# EAGLE schematic RGB_speakerbadge_thruvias (EAGLE 5.11)

## Sheet 1 of 2
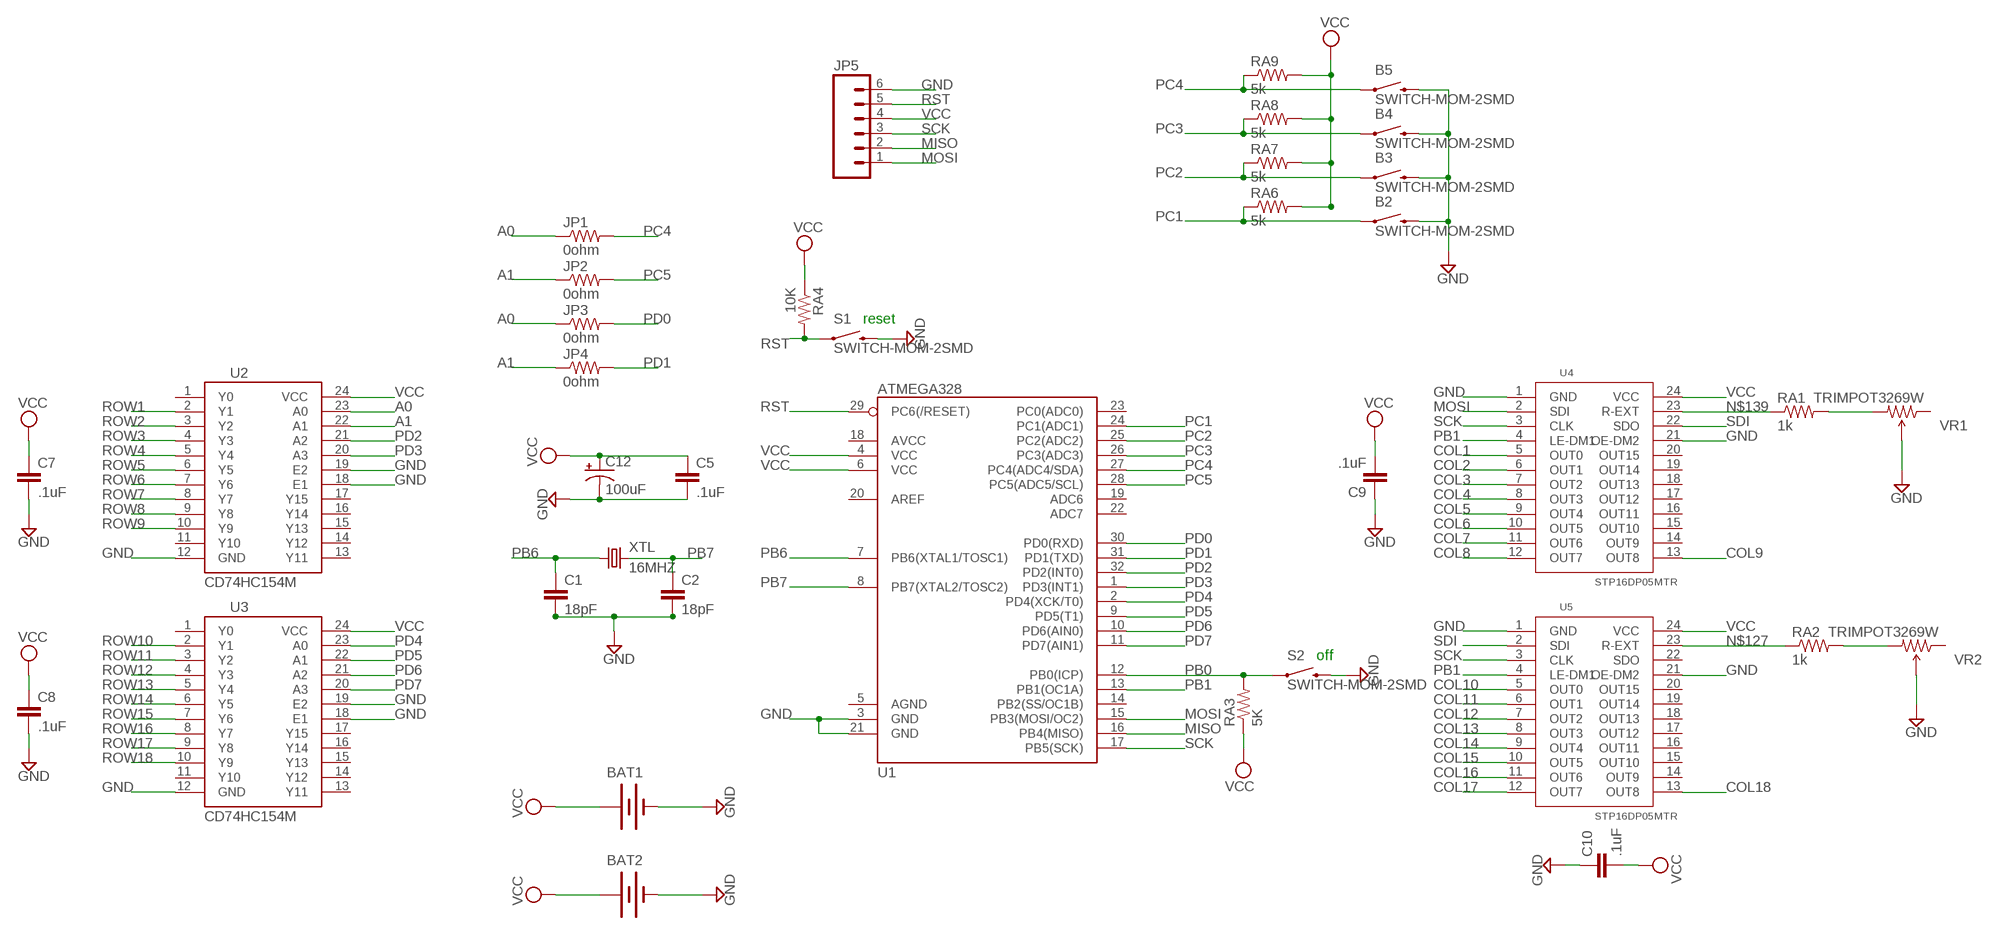
[diagram p0: schematic, sheet 1]

### Parts
B2  SWITCH-MOM-2SMD  SWITCH-MOMENTARY-2SMD  [TACTILE_SWITCH_SMD]
B3  SWITCH-MOM-2SMD  SWITCH-MOMENTARY-2SMD  [TACTILE_SWITCH_SMD]
B4  SWITCH-MOM-2SMD  SWITCH-MOMENTARY-2SMD  [TACTILE_SWITCH_SMD]
B5  SWITCH-MOM-2SMD  SWITCH-MOMENTARY-2SMD  [TACTILE_SWITCH_SMD]
BAT1  NSL_SPARKFUN_BATTERY245MM  [NSL_SPARKFUN_BATTCON_245MM]
BAT2  NSL_SPARKFUN_BATTERY245MM  [NSL_SPARKFUN_BATTCON_245MM]
C1  18pF  SPARKFUN_CAP0603-CAP  [SPARKFUN_0603-CAP]
C2  18pF  SPARKFUN_CAP0603-CAP  [SPARKFUN_0603-CAP]
C5  .1uF  SPARKFUN_CAP0603-CAP  [SPARKFUN_0603-CAP]
C7  .1uF  SPARKFUN_CAP0603-CAP  [SPARKFUN_0603-CAP]
C8  .1uF  SPARKFUN_CAP0603-CAP  [SPARKFUN_0603-CAP]
C9  .1uF  SPARKFUN_CAP0603-CAP  [SPARKFUN_0603-CAP]
C10  .1uF  SPARKFUN_CAP0603-CAP  [SPARKFUN_0603-CAP]
C12  100uF  CAP_POLD  [PANASONIC_D]
JP1  0ohm  SPARKFUN_RESISTOR0603-RES  [SPARKFUN_0603-RES]
JP2  0ohm  SPARKFUN_RESISTOR0603-RES  [SPARKFUN_0603-RES]
JP3  0ohm  SPARKFUN_RESISTOR0603-RES  [SPARKFUN_0603-RES]
JP4  0ohm  SPARKFUN_RESISTOR0603-RES  [SPARKFUN_0603-RES]
JP5  M061X06-SMD_EDGE_FEMALE  [1X06-SMD_EDGE]
RA1  1k  SPARKFUN_RESISTOR0603-RES  [SPARKFUN_0603-RES]
RA2  1k  SPARKFUN_RESISTOR0603-RES  [SPARKFUN_0603-RES]
RA3  5K  SPARKFUN_RESISTOR0603-RES  [SPARKFUN_0603-RES]
RA4  10K  SPARKFUN_RESISTOR0603-RES  [SPARKFUN_0603-RES]
RA6  5k  SPARKFUN_RESISTOR0603-RES  [SPARKFUN_0603-RES]
RA7  5k  SPARKFUN_RESISTOR0603-RES  [SPARKFUN_0603-RES]
RA8  5k  SPARKFUN_RESISTOR0603-RES  [SPARKFUN_0603-RES]
RA9  5k  SPARKFUN_RESISTOR0603-RES  [SPARKFUN_0603-RES]
S1  SWITCH-MOM-2SMD  SWITCH-MOMENTARY-2SMD  [TACTILE_SWITCH_SMD]
S2  SWITCH-MOM-2SMD  SWITCH-MOMENTARY-2SMD  [TACTILE_SWITCH_SMD]
U1  ATMEGA328  ATMEGA168  [TQFP32-08]
U2  CD74HC154M  [SO-24DW]
U3  CD74HC154M  [SO-24DW]
U4  STP16DP05MTR  [STP16DP05MTR]
U5  STP16DP05MTR  [STP16DP05MTR]
VR1  TRIMPOT3269W  [3269W]
VR2  TRIMPOT3269W  [3269W]
XTL  16MHZ  CRYSTALSMD  [HC49UP]

### Nets
A0: JP1.1 JP3.1 U2.23(A0)
A1: JP2.1 JP4.1 U2.22(A1)
COL1: U4.5(OUT0) ; also sheet 2
COL2: U4.6(OUT1) ; also sheet 2
COL3: U4.7(OUT2) ; also sheet 2
COL4: U4.8(OUT3) ; also sheet 2
COL5: U4.9(OUT4) ; also sheet 2
COL6: U4.10(OUT5) ; also sheet 2
COL7: U4.11(OUT6) ; also sheet 2
COL8: U4.12(OUT7)
COL9: U4.13(OUT8) ; also sheet 2
COL10: U5.5(OUT0) ; also sheet 2
COL11: U5.6(OUT1) ; also sheet 2
COL12: U5.7(OUT2) ; also sheet 2
COL13: U5.8(OUT3) ; also sheet 2
COL14: U5.9(OUT4) ; also sheet 2
COL15: U5.10(OUT5) ; also sheet 2
COL16: U5.11(OUT6) ; also sheet 2
COL17: U5.12(OUT7)
COL18: U5.13(OUT8) ; also sheet 2
GND: B2.3 B3.3 B4.3 B5.3 BAT1.2(-) BAT2.2(-) C1.2 C2.2 C5.2 C7.2 C8.2 C9.1 C10.1 C12.- JP5.6 S1.3 S2.3 U1.3(GND) U1.21(GND) U2.12(GND) U2.18(E1) U2.19(E2) U3.12(GND) U3.18(E1) U3.19(E2) U4.1(GND) U4.21(OE-DM2) U5.1(GND) U5.21(OE-DM2) VR1.2(WIPER) VR2.2(WIPER)
MISO: JP5.2 U1.16(PB4(MISO))
MOSI: JP5.1 U1.15(PB3(MOSI/OC2)) U4.2(SDI)
N$37: RA1.2 VR1.3(CW)
N$38: RA2.2 VR2.3(CW)
N$127: RA2.1 U5.23(R-EXT)
N$139: RA1.1 U4.23(R-EXT)
PB0: RA3.2 S2.1 U1.12(PB0(ICP))
PB1: U1.13(PB1(OC1A)) U4.4(LE-DM1) U5.4(LE-DM1)
PB6: C1.1 U1.7(PB6(XTAL1/TOSC1)) XTL.1
PB7: C2.1 U1.8(PB7(XTAL2/TOSC2)) XTL.2
PC1: B2.1 RA6.1 U1.24(PC1(ADC1))
PC2: B3.1 RA7.1 U1.25(PC2(ADC2))
PC3: B4.1 RA8.1 U1.26(PC3(ADC3))
PC4: B5.1 JP1.2 RA9.1 U1.27(PC4(ADC4/SDA))
PC5: JP2.2 U1.28(PC5(ADC5/SCL))
PD0: JP3.2 U1.30(PD0(RXD))
PD1: JP4.2 U1.31(PD1(TXD))
PD2: U1.32(PD2(INT0)) U2.21(A2)
PD3: U1.1(PD3(INT1)) U2.20(A3)
PD4: U1.2(PD4(XCK/T0)) U3.23(A0)
PD5: U1.9(PD5(T1)) U3.22(A1)
PD6: U1.10(PD6(AIN0)) U3.21(A2)
PD7: U1.11(PD7(AIN1)) U3.20(A3)
ROW1: U2.2(Y1) ; also sheet 2
ROW2: U2.3(Y2) ; also sheet 2
ROW3: U2.4(Y3) ; also sheet 2
ROW4: U2.5(Y4) ; also sheet 2
ROW5: U2.6(Y5) ; also sheet 2
ROW6: U2.7(Y6) ; also sheet 2
ROW7: U2.8(Y7) ; also sheet 2
ROW8: U2.9(Y8) ; also sheet 2
ROW9: U2.10(Y9) ; also sheet 2
ROW10: U3.2(Y1) ; also sheet 2
ROW11: U3.3(Y2) ; also sheet 2
ROW12: U3.4(Y3) ; also sheet 2
ROW13: U3.5(Y4) ; also sheet 2
ROW14: U3.6(Y5) ; also sheet 2
ROW15: U3.7(Y6) ; also sheet 2
ROW16: U3.8(Y7) ; also sheet 2
ROW17: U3.9(Y8) ; also sheet 2
ROW18: U3.10(Y9) ; also sheet 2
RST: JP5.5 RA4.2 S1.1 U1.29(PC6(/RESET))
SCK: JP5.3 U1.17(PB5(SCK)) U4.3(CLK) U5.3(CLK)
SDI: U4.22(SDO) U5.2(SDI)
VCC: BAT1.1(+) BAT2.1(+) C5.1 C7.1 C8.1 C9.2 C10.2 C12.+ JP5.4 RA3.1 RA4.1 RA6.2 RA7.2 RA8.2 RA9.2 U1.4(VCC) U1.6(VCC) U2.24(VCC) U3.24(VCC) U4.24(VCC) U5.24(VCC) ; also sheet 2
Unconnected: U1.5(AGND) U1.14(PB2(SS/OC1B)) U1.18(AVCC) U1.19(ADC6) U1.20(AREF) U1.22(ADC7) U1.23(PC0(ADC0)) U2.1(Y0) U2.11(Y10) U2.13(Y11) U2.14(Y12) U2.15(Y13) U2.16(Y14) U2.17(Y15) U3.1(Y0) U3.11(Y10) U3.13(Y11) U3.14(Y12) U3.15(Y13) U3.16(Y14) U3.17(Y15) U4.14(OUT9) U4.15(OUT10) U4.16(OUT11) U4.17(OUT12) U4.18(OUT13) U4.19(OUT14) U4.20(OUT15) U5.14(OUT9) U5.15(OUT10) U5.16(OUT11) U5.17(OUT12) U5.18(OUT13) U5.19(OUT14) U5.20(OUT15) U5.22(SDO) VR1.1(CCW) VR2.1(CCW)

### Notes on the sheet
- reset
- off

## Sheet 2 of 2
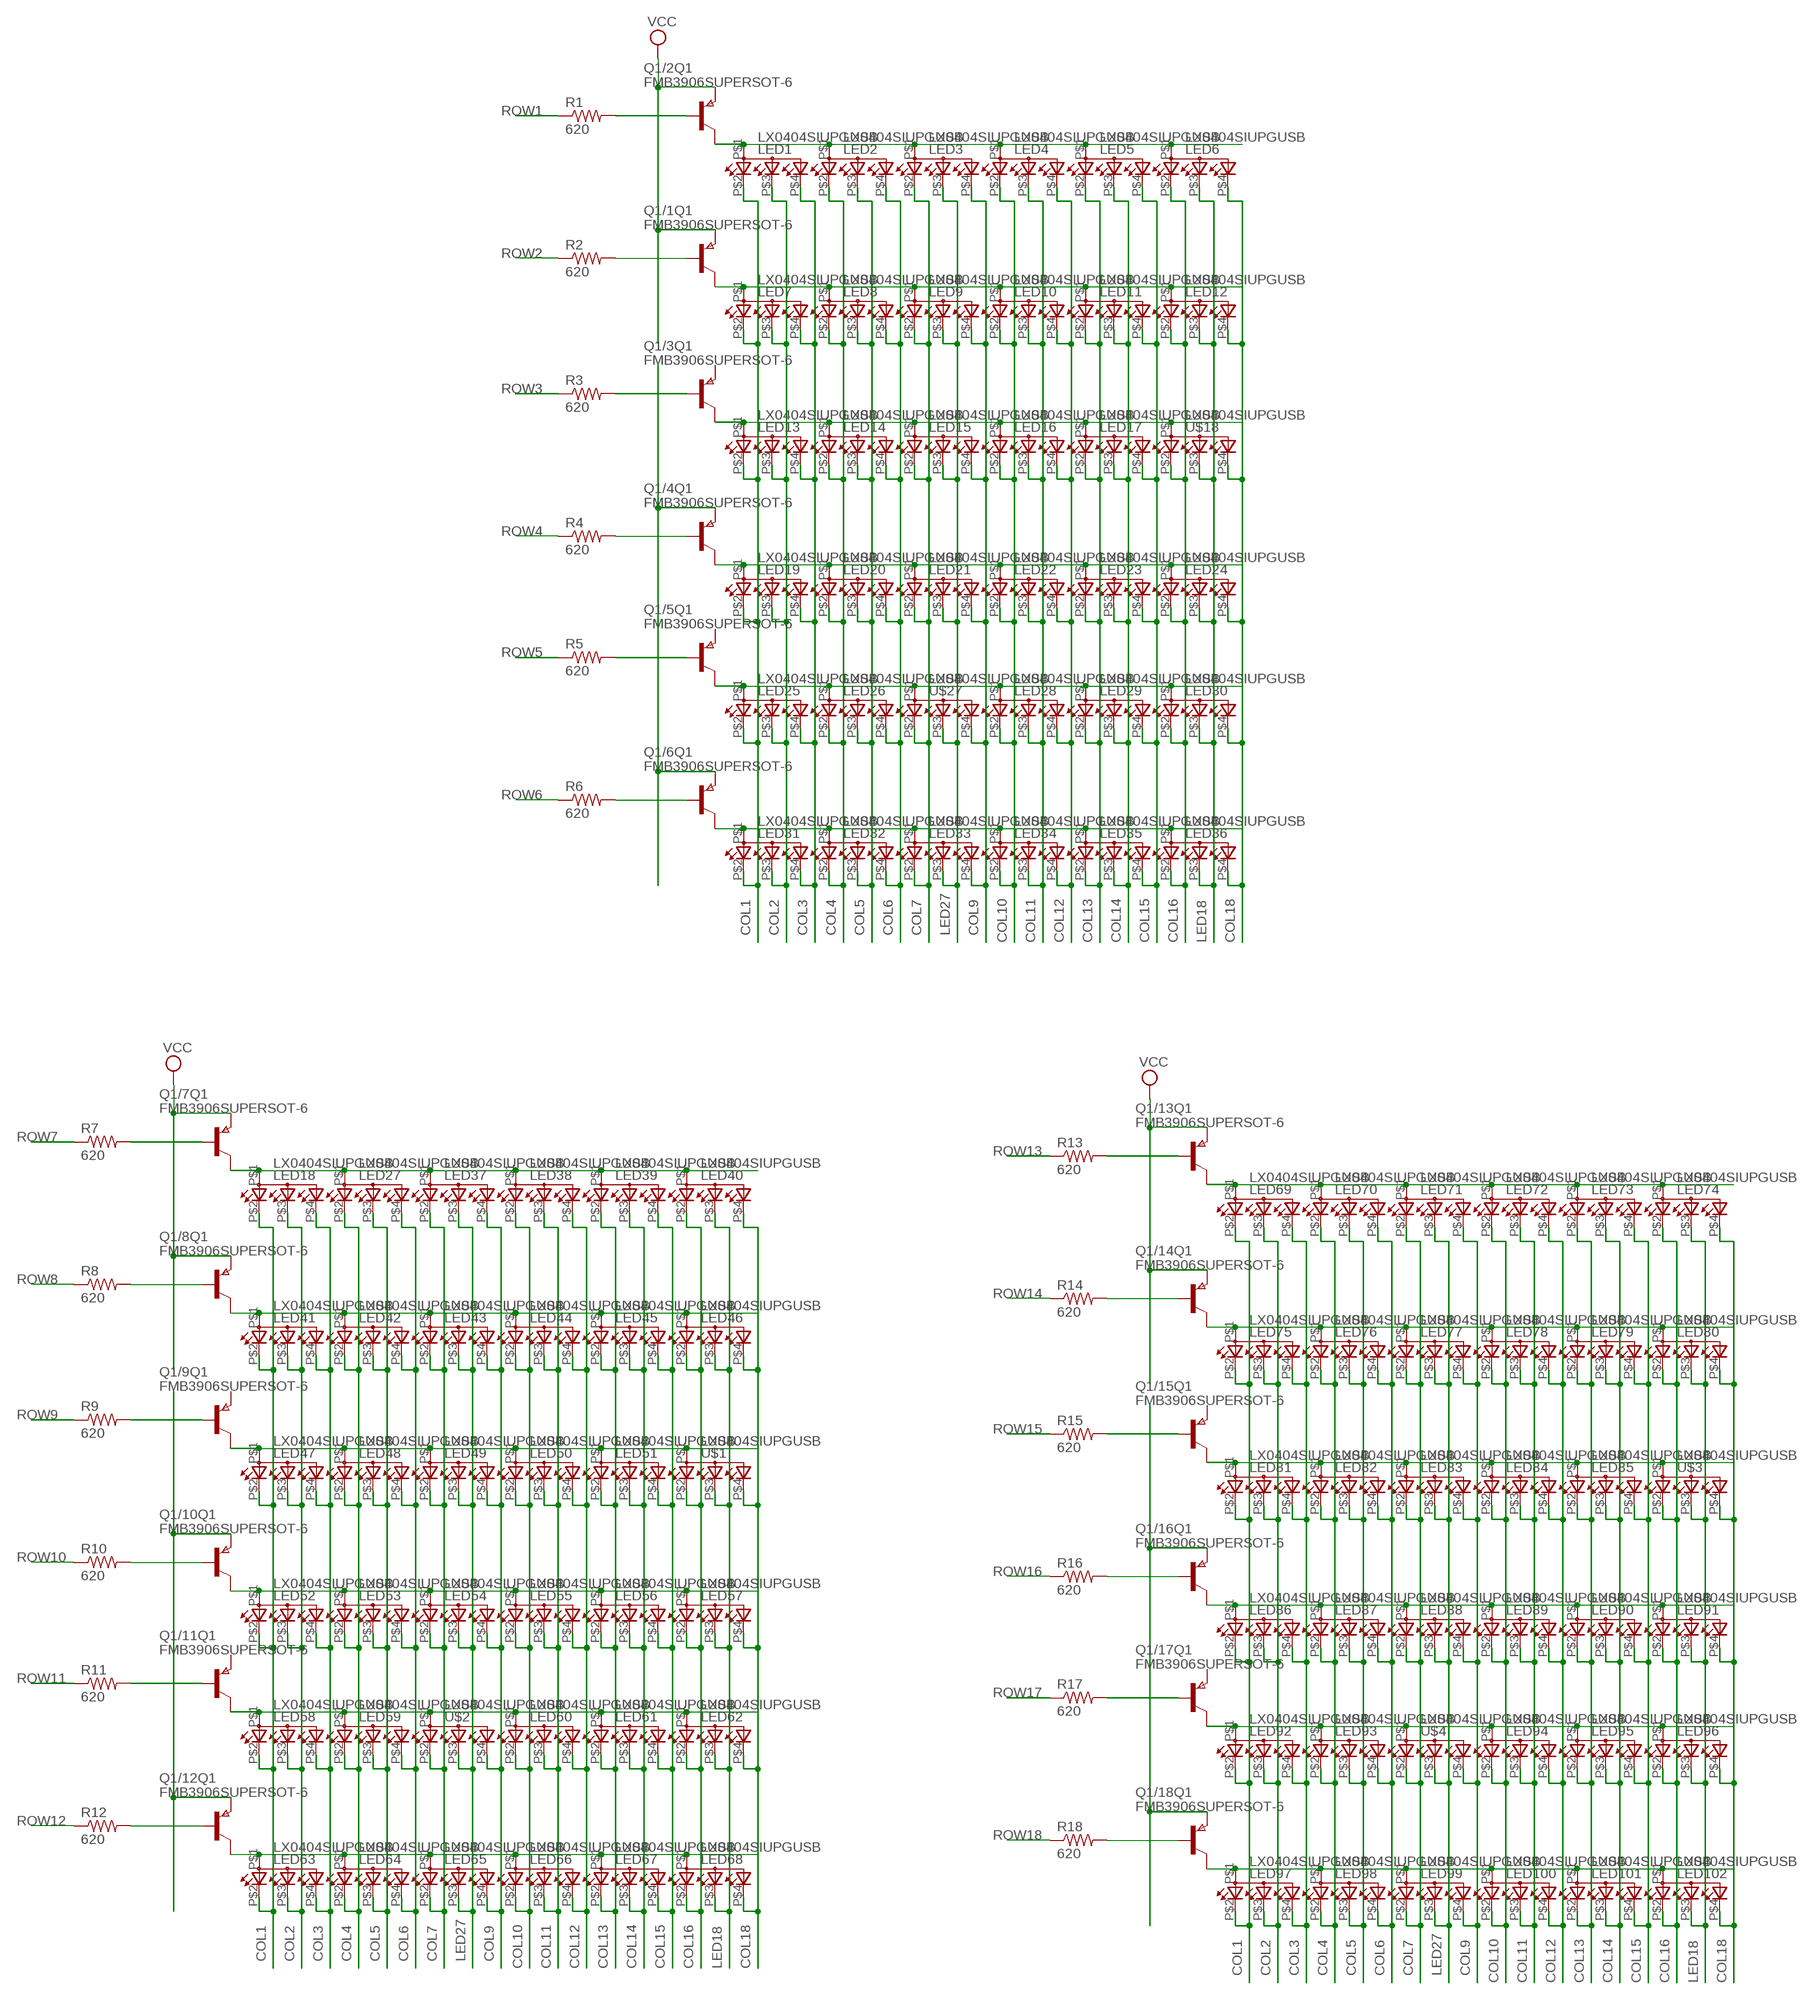
[diagram p1: schematic, sheet 2]

### Parts
LED1  LX0404SIUPGUSB  [0404_LED]
LED2  LX0404SIUPGUSB  [0404_LED]
LED3  LX0404SIUPGUSB  [0404_LED]
LED4  LX0404SIUPGUSB  [0404_LED]
LED5  LX0404SIUPGUSB  [0404_LED]
LED6  LX0404SIUPGUSB  [0404_LED]
LED7  LX0404SIUPGUSB  [0404_LED]
LED8  LX0404SIUPGUSB  [0404_LED]
LED9  LX0404SIUPGUSB  [0404_LED]
LED10  LX0404SIUPGUSB  [0404_LED]
LED11  LX0404SIUPGUSB  [0404_LED]
LED12  LX0404SIUPGUSB  [0404_LED]
LED13  LX0404SIUPGUSB  [0404_LED]
LED14  LX0404SIUPGUSB  [0404_LED]
LED15  LX0404SIUPGUSB  [0404_LED]
LED16  LX0404SIUPGUSB  [0404_LED]
LED17  LX0404SIUPGUSB  [0404_LED]
LED18  LX0404SIUPGUSB  [0404_LED]
LED19  LX0404SIUPGUSB  [0404_LED]
LED20  LX0404SIUPGUSB  [0404_LED]
LED21  LX0404SIUPGUSB  [0404_LED]
LED22  LX0404SIUPGUSB  [0404_LED]
LED23  LX0404SIUPGUSB  [0404_LED]
LED24  LX0404SIUPGUSB  [0404_LED]
LED25  LX0404SIUPGUSB  [0404_LED]
LED26  LX0404SIUPGUSB  [0404_LED]
LED27  LX0404SIUPGUSB  [0404_LED]
LED28  LX0404SIUPGUSB  [0404_LED]
LED29  LX0404SIUPGUSB  [0404_LED]
LED30  LX0404SIUPGUSB  [0404_LED]
LED31  LX0404SIUPGUSB  [0404_LED]
LED32  LX0404SIUPGUSB  [0404_LED]
LED33  LX0404SIUPGUSB  [0404_LED]
LED34  LX0404SIUPGUSB  [0404_LED]
LED35  LX0404SIUPGUSB  [0404_LED]
LED36  LX0404SIUPGUSB  [0404_LED]
LED37  LX0404SIUPGUSB  [0404_LED]
LED38  LX0404SIUPGUSB  [0404_LED]
LED39  LX0404SIUPGUSB  [0404_LED]
LED40  LX0404SIUPGUSB  [0404_LED]
LED41  LX0404SIUPGUSB  [0404_LED]
LED42  LX0404SIUPGUSB  [0404_LED]
LED43  LX0404SIUPGUSB  [0404_LED]
LED44  LX0404SIUPGUSB  [0404_LED]
LED45  LX0404SIUPGUSB  [0404_LED]
LED46  LX0404SIUPGUSB  [0404_LED]
LED47  LX0404SIUPGUSB  [0404_LED]
LED48  LX0404SIUPGUSB  [0404_LED]
LED49  LX0404SIUPGUSB  [0404_LED]
LED50  LX0404SIUPGUSB  [0404_LED]
LED51  LX0404SIUPGUSB  [0404_LED]
LED52  LX0404SIUPGUSB  [0404_LED]
LED53  LX0404SIUPGUSB  [0404_LED]
LED54  LX0404SIUPGUSB  [0404_LED]
LED55  LX0404SIUPGUSB  [0404_LED]
LED56  LX0404SIUPGUSB  [0404_LED]
LED57  LX0404SIUPGUSB  [0404_LED]
LED58  LX0404SIUPGUSB  [0404_LED]
LED59  LX0404SIUPGUSB  [0404_LED]
LED60  LX0404SIUPGUSB  [0404_LED]
LED61  LX0404SIUPGUSB  [0404_LED]
LED62  LX0404SIUPGUSB  [0404_LED]
LED63  LX0404SIUPGUSB  [0404_LED]
LED64  LX0404SIUPGUSB  [0404_LED]
LED65  LX0404SIUPGUSB  [0404_LED]
LED66  LX0404SIUPGUSB  [0404_LED]
LED67  LX0404SIUPGUSB  [0404_LED]
LED68  LX0404SIUPGUSB  [0404_LED]
LED69  LX0404SIUPGUSB  [0404_LED]
LED70  LX0404SIUPGUSB  [0404_LED]
LED71  LX0404SIUPGUSB  [0404_LED]
LED72  LX0404SIUPGUSB  [0404_LED]
LED73  LX0404SIUPGUSB  [0404_LED]
LED74  LX0404SIUPGUSB  [0404_LED]
LED75  LX0404SIUPGUSB  [0404_LED]
LED76  LX0404SIUPGUSB  [0404_LED]
LED77  LX0404SIUPGUSB  [0404_LED]
LED78  LX0404SIUPGUSB  [0404_LED]
LED79  LX0404SIUPGUSB  [0404_LED]
LED80  LX0404SIUPGUSB  [0404_LED]
LED81  LX0404SIUPGUSB  [0404_LED]
LED82  LX0404SIUPGUSB  [0404_LED]
LED83  LX0404SIUPGUSB  [0404_LED]
LED84  LX0404SIUPGUSB  [0404_LED]
LED85  LX0404SIUPGUSB  [0404_LED]
LED86  LX0404SIUPGUSB  [0404_LED]
LED87  LX0404SIUPGUSB  [0404_LED]
LED88  LX0404SIUPGUSB  [0404_LED]
LED89  LX0404SIUPGUSB  [0404_LED]
LED90  LX0404SIUPGUSB  [0404_LED]
LED91  LX0404SIUPGUSB  [0404_LED]
LED92  LX0404SIUPGUSB  [0404_LED]
LED93  LX0404SIUPGUSB  [0404_LED]
LED94  LX0404SIUPGUSB  [0404_LED]
LED95  LX0404SIUPGUSB  [0404_LED]
LED96  LX0404SIUPGUSB  [0404_LED]
LED97  LX0404SIUPGUSB  [0404_LED]
LED98  LX0404SIUPGUSB  [0404_LED]
LED99  LX0404SIUPGUSB  [0404_LED]
LED100  LX0404SIUPGUSB  [0404_LED]
LED101  LX0404SIUPGUSB  [0404_LED]
LED102  LX0404SIUPGUSB  [0404_LED]
Q1/1  FMB3906SUPERSOT-6  [SSOT-6]
Q1/2  FMB3906SUPERSOT-6  [SSOT-6]
Q1/3  FMB3906SUPERSOT-6  [SSOT-6]
Q1/4  FMB3906SUPERSOT-6  [SSOT-6]
Q1/5  FMB3906SUPERSOT-6  [SSOT-6]
Q1/6  FMB3906SUPERSOT-6  [SSOT-6]
Q1/7  FMB3906SUPERSOT-6  [SSOT-6]
Q1/8  FMB3906SUPERSOT-6  [SSOT-6]
Q1/9  FMB3906SUPERSOT-6  [SSOT-6]
Q1/10  FMB3906SUPERSOT-6  [SSOT-6]
Q1/11  FMB3906SUPERSOT-6  [SSOT-6]
Q1/12  FMB3906SUPERSOT-6  [SSOT-6]
Q1/13  FMB3906SUPERSOT-6  [SSOT-6]
Q1/14  FMB3906SUPERSOT-6  [SSOT-6]
Q1/15  FMB3906SUPERSOT-6  [SSOT-6]
Q1/16  FMB3906SUPERSOT-6  [SSOT-6]
Q1/17  FMB3906SUPERSOT-6  [SSOT-6]
Q1/18  FMB3906SUPERSOT-6  [SSOT-6]
R1  620  SPARKFUN_RESISTOR0603-RES  [SPARKFUN_0603-RES]
R2  620  SPARKFUN_RESISTOR0603-RES  [SPARKFUN_0603-RES]
R3  620  SPARKFUN_RESISTOR0603-RES  [SPARKFUN_0603-RES]
R4  620  SPARKFUN_RESISTOR0603-RES  [SPARKFUN_0603-RES]
R5  620  SPARKFUN_RESISTOR0603-RES  [SPARKFUN_0603-RES]
R6  620  SPARKFUN_RESISTOR0603-RES  [SPARKFUN_0603-RES]
R7  620  SPARKFUN_RESISTOR0603-RES  [SPARKFUN_0603-RES]
R8  620  SPARKFUN_RESISTOR0603-RES  [SPARKFUN_0603-RES]
R9  620  SPARKFUN_RESISTOR0603-RES  [SPARKFUN_0603-RES]
R10  620  SPARKFUN_RESISTOR0603-RES  [SPARKFUN_0603-RES]
R11  620  SPARKFUN_RESISTOR0603-RES  [SPARKFUN_0603-RES]
R12  620  SPARKFUN_RESISTOR0603-RES  [SPARKFUN_0603-RES]
R13  620  SPARKFUN_RESISTOR0603-RES  [SPARKFUN_0603-RES]
R14  620  SPARKFUN_RESISTOR0603-RES  [SPARKFUN_0603-RES]
R15  620  SPARKFUN_RESISTOR0603-RES  [SPARKFUN_0603-RES]
R16  620  SPARKFUN_RESISTOR0603-RES  [SPARKFUN_0603-RES]
R17  620  SPARKFUN_RESISTOR0603-RES  [SPARKFUN_0603-RES]
R18  620  SPARKFUN_RESISTOR0603-RES  [SPARKFUN_0603-RES]
U$1  LX0404SIUPGUSB  [0404_LED]
U$2  LX0404SIUPGUSB  [0404_LED]
U$3  LX0404SIUPGUSB  [0404_LED]
U$4  LX0404SIUPGUSB  [0404_LED]
U$18  LX0404SIUPGUSB  [0404_LED]
U$27  LX0404SIUPGUSB  [0404_LED]

### Nets
COL1: LED1.P$2(CRED) LED7.P$2(CRED) LED13.P$2(CRED) LED18.P$2(CRED) LED19.P$2(CRED) LED25.P$2(CRED) LED31.P$2(CRED) LED41.P$2(CRED) LED47.P$2(CRED) LED52.P$2(CRED) LED58.P$2(CRED) LED63.P$2(CRED) LED69.P$2(CRED) LED75.P$2(CRED) LED81.P$2(CRED) LED86.P$2(CRED) LED92.P$2(CRED) LED97.P$2(CRED) ; also sheet 1
COL2: LED1.P$3(CBLUE) LED7.P$3(CBLUE) LED13.P$3(CBLUE) LED18.P$3(CBLUE) LED19.P$3(CBLUE) LED25.P$3(CBLUE) LED31.P$3(CBLUE) LED41.P$3(CBLUE) LED47.P$3(CBLUE) LED52.P$3(CBLUE) LED58.P$3(CBLUE) LED63.P$3(CBLUE) LED69.P$3(CBLUE) LED75.P$3(CBLUE) LED81.P$3(CBLUE) LED86.P$3(CBLUE) LED92.P$3(CBLUE) LED97.P$3(CBLUE) ; also sheet 1
COL3: LED1.P$4(CGREEN) LED7.P$4(CGREEN) LED13.P$4(CGREEN) LED18.P$4(CGREEN) LED19.P$4(CGREEN) LED25.P$4(CGREEN) LED31.P$4(CGREEN) LED41.P$4(CGREEN) LED47.P$4(CGREEN) LED52.P$4(CGREEN) LED58.P$4(CGREEN) LED63.P$4(CGREEN) LED69.P$4(CGREEN) LED75.P$4(CGREEN) LED81.P$4(CGREEN) LED86.P$4(CGREEN) LED92.P$4(CGREEN) LED97.P$4(CGREEN) ; also sheet 1
COL4: LED2.P$2(CRED) LED8.P$2(CRED) LED14.P$2(CRED) LED20.P$2(CRED) LED26.P$2(CRED) LED27.P$2(CRED) LED32.P$2(CRED) LED42.P$2(CRED) LED48.P$2(CRED) LED53.P$2(CRED) LED59.P$2(CRED) LED64.P$2(CRED) LED70.P$2(CRED) LED76.P$2(CRED) LED82.P$2(CRED) LED87.P$2(CRED) LED93.P$2(CRED) LED98.P$2(CRED) ; also sheet 1
COL5: LED2.P$3(CBLUE) LED8.P$3(CBLUE) LED14.P$3(CBLUE) LED20.P$3(CBLUE) LED26.P$3(CBLUE) LED27.P$3(CBLUE) LED32.P$3(CBLUE) LED42.P$3(CBLUE) LED48.P$3(CBLUE) LED53.P$3(CBLUE) LED59.P$3(CBLUE) LED64.P$3(CBLUE) LED70.P$3(CBLUE) LED76.P$3(CBLUE) LED82.P$3(CBLUE) LED87.P$3(CBLUE) LED93.P$3(CBLUE) LED98.P$3(CBLUE) ; also sheet 1
COL6: LED2.P$4(CGREEN) LED8.P$4(CGREEN) LED14.P$4(CGREEN) LED20.P$4(CGREEN) LED26.P$4(CGREEN) LED27.P$4(CGREEN) LED32.P$4(CGREEN) LED42.P$4(CGREEN) LED48.P$4(CGREEN) LED53.P$4(CGREEN) LED59.P$4(CGREEN) LED64.P$4(CGREEN) LED70.P$4(CGREEN) LED76.P$4(CGREEN) LED82.P$4(CGREEN) LED87.P$4(CGREEN) LED93.P$4(CGREEN) LED98.P$4(CGREEN) ; also sheet 1
COL7: LED3.P$2(CRED) LED9.P$2(CRED) LED15.P$2(CRED) LED21.P$2(CRED) LED33.P$2(CRED) LED37.P$2(CRED) LED43.P$2(CRED) LED49.P$2(CRED) LED54.P$2(CRED) LED65.P$2(CRED) LED71.P$2(CRED) LED77.P$2(CRED) LED83.P$2(CRED) LED88.P$2(CRED) LED99.P$2(CRED) U$2.P$2(CRED) U$4.P$2(CRED) U$27.P$2(CRED) ; also sheet 1
COL9: LED3.P$4(CGREEN) LED9.P$4(CGREEN) LED15.P$4(CGREEN) LED21.P$4(CGREEN) LED33.P$4(CGREEN) LED37.P$4(CGREEN) LED43.P$4(CGREEN) LED49.P$4(CGREEN) LED54.P$4(CGREEN) LED65.P$4(CGREEN) LED71.P$4(CGREEN) LED77.P$4(CGREEN) LED83.P$4(CGREEN) LED88.P$4(CGREEN) LED99.P$4(CGREEN) U$2.P$4(CGREEN) U$4.P$4(CGREEN) U$27.P$4(CGREEN) ; also sheet 1
COL10: LED4.P$2(CRED) LED10.P$2(CRED) LED16.P$2(CRED) LED22.P$2(CRED) LED28.P$2(CRED) LED34.P$2(CRED) LED38.P$2(CRED) LED44.P$2(CRED) LED50.P$2(CRED) LED55.P$2(CRED) LED60.P$2(CRED) LED66.P$2(CRED) LED72.P$2(CRED) LED78.P$2(CRED) LED84.P$2(CRED) LED89.P$2(CRED) LED94.P$2(CRED) LED100.P$2(CRED) ; also sheet 1
COL11: LED4.P$3(CBLUE) LED10.P$3(CBLUE) LED16.P$3(CBLUE) LED22.P$3(CBLUE) LED28.P$3(CBLUE) LED34.P$3(CBLUE) LED38.P$3(CBLUE) LED44.P$3(CBLUE) LED50.P$3(CBLUE) LED55.P$3(CBLUE) LED60.P$3(CBLUE) LED66.P$3(CBLUE) LED72.P$3(CBLUE) LED78.P$3(CBLUE) LED84.P$3(CBLUE) LED89.P$3(CBLUE) LED94.P$3(CBLUE) LED100.P$3(CBLUE) ; also sheet 1
COL12: LED4.P$4(CGREEN) LED10.P$4(CGREEN) LED16.P$4(CGREEN) LED22.P$4(CGREEN) LED28.P$4(CGREEN) LED34.P$4(CGREEN) LED38.P$4(CGREEN) LED44.P$4(CGREEN) LED50.P$4(CGREEN) LED55.P$4(CGREEN) LED60.P$4(CGREEN) LED66.P$4(CGREEN) LED72.P$4(CGREEN) LED78.P$4(CGREEN) LED84.P$4(CGREEN) LED89.P$4(CGREEN) LED94.P$4(CGREEN) LED100.P$4(CGREEN) ; also sheet 1
COL13: LED5.P$2(CRED) LED11.P$2(CRED) LED17.P$2(CRED) LED23.P$2(CRED) LED29.P$2(CRED) LED35.P$2(CRED) LED39.P$2(CRED) LED45.P$2(CRED) LED51.P$2(CRED) LED56.P$2(CRED) LED61.P$2(CRED) LED67.P$2(CRED) LED73.P$2(CRED) LED79.P$2(CRED) LED85.P$2(CRED) LED90.P$2(CRED) LED95.P$2(CRED) LED101.P$2(CRED) ; also sheet 1
COL14: LED5.P$3(CBLUE) LED11.P$3(CBLUE) LED17.P$3(CBLUE) LED23.P$3(CBLUE) LED29.P$3(CBLUE) LED35.P$3(CBLUE) LED39.P$3(CBLUE) LED45.P$3(CBLUE) LED51.P$3(CBLUE) LED56.P$3(CBLUE) LED61.P$3(CBLUE) LED67.P$3(CBLUE) LED73.P$3(CBLUE) LED79.P$3(CBLUE) LED85.P$3(CBLUE) LED90.P$3(CBLUE) LED95.P$3(CBLUE) LED101.P$3(CBLUE) ; also sheet 1
COL15: LED5.P$4(CGREEN) LED11.P$4(CGREEN) LED17.P$4(CGREEN) LED23.P$4(CGREEN) LED29.P$4(CGREEN) LED35.P$4(CGREEN) LED39.P$4(CGREEN) LED45.P$4(CGREEN) LED51.P$4(CGREEN) LED56.P$4(CGREEN) LED61.P$4(CGREEN) LED67.P$4(CGREEN) LED73.P$4(CGREEN) LED79.P$4(CGREEN) LED85.P$4(CGREEN) LED90.P$4(CGREEN) LED95.P$4(CGREEN) LED101.P$4(CGREEN) ; also sheet 1
COL16: LED6.P$2(CRED) LED12.P$2(CRED) LED24.P$2(CRED) LED30.P$2(CRED) LED36.P$2(CRED) LED40.P$2(CRED) LED46.P$2(CRED) LED57.P$2(CRED) LED62.P$2(CRED) LED68.P$2(CRED) LED74.P$2(CRED) LED80.P$2(CRED) LED91.P$2(CRED) LED96.P$2(CRED) LED102.P$2(CRED) U$1.P$2(CRED) U$3.P$2(CRED) U$18.P$2(CRED) ; also sheet 1
COL18: LED6.P$4(CGREEN) LED12.P$4(CGREEN) LED24.P$4(CGREEN) LED30.P$4(CGREEN) LED36.P$4(CGREEN) LED40.P$4(CGREEN) LED46.P$4(CGREEN) LED57.P$4(CGREEN) LED62.P$4(CGREEN) LED68.P$4(CGREEN) LED74.P$4(CGREEN) LED80.P$4(CGREEN) LED91.P$4(CGREEN) LED96.P$4(CGREEN) LED102.P$4(CGREEN) U$1.P$4(CGREEN) U$3.P$4(CGREEN) U$18.P$4(CGREEN) ; also sheet 1
LED18: LED6.P$3(CBLUE) LED12.P$3(CBLUE) LED24.P$3(CBLUE) LED30.P$3(CBLUE) LED36.P$3(CBLUE) LED40.P$3(CBLUE) LED46.P$3(CBLUE) LED57.P$3(CBLUE) LED62.P$3(CBLUE) LED68.P$3(CBLUE) LED74.P$3(CBLUE) LED80.P$3(CBLUE) LED91.P$3(CBLUE) LED96.P$3(CBLUE) LED102.P$3(CBLUE) U$1.P$3(CBLUE) U$3.P$3(CBLUE) U$18.P$3(CBLUE)
LED27: LED3.P$3(CBLUE) LED9.P$3(CBLUE) LED15.P$3(CBLUE) LED21.P$3(CBLUE) LED33.P$3(CBLUE) LED37.P$3(CBLUE) LED43.P$3(CBLUE) LED49.P$3(CBLUE) LED54.P$3(CBLUE) LED65.P$3(CBLUE) LED71.P$3(CBLUE) LED77.P$3(CBLUE) LED83.P$3(CBLUE) LED88.P$3(CBLUE) LED99.P$3(CBLUE) U$2.P$3(CBLUE) U$4.P$3(CBLUE) U$27.P$3(CBLUE)
LINE1: LED1.P$1(A) LED2.P$1(A) LED3.P$1(A) LED4.P$1(A) LED5.P$1(A) LED6.P$1(A) Q1/2.6(Q1:C)
LINE2: LED7.P$1(A) LED8.P$1(A) LED9.P$1(A) LED10.P$1(A) LED11.P$1(A) LED12.P$1(A) Q1/1.6(Q1:C)
LINE3: LED13.P$1(A) LED14.P$1(A) LED15.P$1(A) LED16.P$1(A) LED17.P$1(A) Q1/3.6(Q1:C) U$18.P$1(A)
LINE4: LED19.P$1(A) LED20.P$1(A) LED21.P$1(A) LED22.P$1(A) LED23.P$1(A) LED24.P$1(A) Q1/4.6(Q1:C)
LINE5: LED25.P$1(A) LED26.P$1(A) LED28.P$1(A) LED29.P$1(A) LED30.P$1(A) Q1/5.6(Q1:C) U$27.P$1(A)
LINE6: LED31.P$1(A) LED32.P$1(A) LED33.P$1(A) LED34.P$1(A) LED35.P$1(A) LED36.P$1(A) Q1/6.6(Q1:C)
LINE7: LED18.P$1(A) LED27.P$1(A) LED37.P$1(A) LED38.P$1(A) LED39.P$1(A) LED40.P$1(A) Q1/7.6(Q1:C)
LINE8: LED41.P$1(A) LED42.P$1(A) LED43.P$1(A) LED44.P$1(A) LED45.P$1(A) LED46.P$1(A) Q1/8.6(Q1:C)
LINE9: LED47.P$1(A) LED48.P$1(A) LED49.P$1(A) LED50.P$1(A) LED51.P$1(A) Q1/9.6(Q1:C) U$1.P$1(A)
LINE10: LED52.P$1(A) LED53.P$1(A) LED54.P$1(A) LED55.P$1(A) LED56.P$1(A) LED57.P$1(A) Q1/10.6(Q1:C)
LINE11: LED58.P$1(A) LED59.P$1(A) LED60.P$1(A) LED61.P$1(A) LED62.P$1(A) Q1/11.6(Q1:C) U$2.P$1(A)
LINE12: LED63.P$1(A) LED64.P$1(A) LED65.P$1(A) LED66.P$1(A) LED67.P$1(A) LED68.P$1(A) Q1/12.6(Q1:C)
LINE13: LED69.P$1(A) LED70.P$1(A) LED71.P$1(A) LED72.P$1(A) LED73.P$1(A) LED74.P$1(A) Q1/13.6(Q1:C)
LINE14: LED75.P$1(A) LED76.P$1(A) LED77.P$1(A) LED78.P$1(A) LED79.P$1(A) LED80.P$1(A) Q1/14.6(Q1:C)
LINE15: LED81.P$1(A) LED82.P$1(A) LED83.P$1(A) LED84.P$1(A) LED85.P$1(A) Q1/15.6(Q1:C) U$3.P$1(A)
LINE16: LED86.P$1(A) LED87.P$1(A) LED88.P$1(A) LED89.P$1(A) LED90.P$1(A) LED91.P$1(A) Q1/16.6(Q1:C)
LINE17: LED92.P$1(A) LED93.P$1(A) LED94.P$1(A) LED95.P$1(A) LED96.P$1(A) Q1/17.6(Q1:C) U$4.P$1(A)
LINE18: LED97.P$1(A) LED98.P$1(A) LED99.P$1(A) LED100.P$1(A) LED101.P$1(A) LED102.P$1(A) Q1/18.6(Q1:C)
N$1: Q1/7.1(Q1:B) R7.2
N$2: Q1/2.1(Q1:B) R1.2
N$3: Q1/8.1(Q1:B) R8.2
N$4: Q1/9.1(Q1:B) R9.2
N$5: Q1/10.1(Q1:B) R10.2
N$6: Q1/5.1(Q1:B) R5.2
N$7: Q1/11.1(Q1:B) R11.2
N$8: Q1/1.1(Q1:B) R2.2
N$9: Q1/12.1(Q1:B) R12.2
N$10: Q1/3.1(Q1:B) R3.2
N$11: Q1/13.1(Q1:B) R13.2
N$12: Q1/14.1(Q1:B) R14.2
N$13: Q1/15.1(Q1:B) R15.2
N$14: Q1/16.1(Q1:B) R16.2
N$15: Q1/17.1(Q1:B) R17.2
N$16: Q1/18.1(Q1:B) R18.2
N$48: Q1/4.1(Q1:B) R4.2
N$55: Q1/6.1(Q1:B) R6.2
ROW1: R1.1 ; also sheet 1
ROW2: R2.1 ; also sheet 1
ROW3: R3.1 ; also sheet 1
ROW4: R4.1 ; also sheet 1
ROW5: R5.1 ; also sheet 1
ROW6: R6.1 ; also sheet 1
ROW7: R7.1 ; also sheet 1
ROW8: R8.1 ; also sheet 1
ROW9: R9.1 ; also sheet 1
ROW10: R10.1 ; also sheet 1
ROW11: R11.1 ; also sheet 1
ROW12: R12.1 ; also sheet 1
ROW13: R13.1 ; also sheet 1
ROW14: R14.1 ; also sheet 1
ROW15: R15.1 ; also sheet 1
ROW16: R16.1 ; also sheet 1
ROW17: R17.1 ; also sheet 1
ROW18: R18.1 ; also sheet 1
VCC: Q1/1.5(Q1:E) Q1/2.5(Q1:E) Q1/4.5(Q1:E) Q1/6.5(Q1:E) Q1/7.5(Q1:E) Q1/8.5(Q1:E) Q1/10.5(Q1:E) Q1/12.5(Q1:E) Q1/13.5(Q1:E) Q1/14.5(Q1:E) Q1/16.5(Q1:E) Q1/18.5(Q1:E) ; also sheet 1
Unconnected: Q1/1.2(Q2:E) Q1/1.3(Q2:B) Q1/1.4(Q2:C) Q1/2.2(Q2:E) Q1/2.3(Q2:B) Q1/2.4(Q2:C) Q1/3.2(Q2:E) Q1/3.3(Q2:B) Q1/3.4(Q2:C) Q1/3.5(Q1:E) Q1/4.2(Q2:E) Q1/4.3(Q2:B) Q1/4.4(Q2:C) Q1/5.2(Q2:E) Q1/5.3(Q2:B) Q1/5.4(Q2:C) Q1/5.5(Q1:E) Q1/6.2(Q2:E) Q1/6.3(Q2:B) Q1/6.4(Q2:C) Q1/7.2(Q2:E) Q1/7.3(Q2:B) Q1/7.4(Q2:C) Q1/8.2(Q2:E) Q1/8.3(Q2:B) Q1/8.4(Q2:C) Q1/9.2(Q2:E) Q1/9.3(Q2:B) Q1/9.4(Q2:C) Q1/9.5(Q1:E) Q1/10.2(Q2:E) Q1/10.3(Q2:B) Q1/10.4(Q2:C) Q1/11.2(Q2:E) Q1/11.3(Q2:B) Q1/11.4(Q2:C) Q1/11.5(Q1:E) Q1/12.2(Q2:E) Q1/12.3(Q2:B) Q1/12.4(Q2:C) Q1/13.2(Q2:E) Q1/13.3(Q2:B) Q1/13.4(Q2:C) Q1/14.2(Q2:E) Q1/14.3(Q2:B) Q1/14.4(Q2:C) Q1/15.2(Q2:E) Q1/15.3(Q2:B) Q1/15.4(Q2:C) Q1/15.5(Q1:E) Q1/16.2(Q2:E) Q1/16.3(Q2:B) Q1/16.4(Q2:C) Q1/17.2(Q2:E) Q1/17.3(Q2:B) Q1/17.4(Q2:C) Q1/17.5(Q1:E) Q1/18.2(Q2:E) Q1/18.3(Q2:B) Q1/18.4(Q2:C)

## Library data of the parts
B2-B5 S1 S2 = SparkFun:SWITCH-MOMENTARY-2
BAT1 BAT2 = Nullspace:NSL_SPARKFUN_BATTERY: Battery Holders Various common sizes : AA, AAA, 20mm coin cell and 12mm coin cell.
C1 C2 C5 C7-C10 = Nullspace:SPARKFUN_CAP: Capacitor Standard 0603 ceramic capacitor, and 0.1" leaded capacitor.
C12 = SparkFun:CAP_POL: Capacitor Polarized These are standard SMD and PTH capacitors. Normally 10uF, 47uF, and 100uF in electrolytic and tantalum varieties. Always verify the external diameter of the through hole cap, it varies with capacity, voltage, and manufacturer. The EIA devices should be standard.
JP1-JP4 R1-R18 RA1-RA4 RA6-RA9 = Nullspace:SPARKFUN_RESISTOR: Resistor Basic schematic elements and footprints for 0603, 1206, and PTH 1/10th watt (small) resistors.
JP5 = SparkFun:M06: Header 6 Standard 6-pin 0.1" header. Use with straight break away headers (SKU : PRT-00116), right angle break away headers (PRT-00553), swiss pins (PRT-00743), machine pins (PRT-00117), and female headers (PRT-00115). Molex polarized connector foot print use with SKU : PRT-08094 with associated crimp pins and housings. NOTES ON THE VARIANTS LOCK and LOCK_LONGPADS... This footprint was designed to help hold the alignment of a through-hole component (i.e. 6-pin header) while soldering it into place. You may notice that each hole has been shifted either up or down by 0.005 of an inch from it's more standard position (which is a perfectly straight line). This slight alteration caused the pins (the squares in the middle) to touch the edges of the holes. Because they are alternating, it causes a "brace" to hold the component in place. 0.005 has proven to be the perfect amount of "off-center" position when using our standard breakaway headers. Although looks a little odd when you look at the bare footprint, once you have a header in there, the alteration is very hard to notice. Also, if you push a header all the way into place, it is covered up entirely on the bottom side. This idea of altering the position of holes to aid alignment will be further integrated into the Sparkfun Library for other footprints. It can help hold any component with 3 or more connection pins.
LED1-LED102 U$1-U$4 U$18 U$27 = 0404_RGB_LED:LX0404SIUPGUSB
Q1/1-Q1/18 = fairchild-semic:FMB3906: FMB3906 This device is designed for general purpose amplifier and switching applications at collector currents of 10 µA to 100 mA
U1 = SparkFun:ATMEGA168
U2 U3 = SparkFun:CD74HC154M: High-Speed CMOS Logic 4- to 16-Line Decoder/Demultiplexer
U4 U5 = Nullspace:STP16DP05MTR: STP16DP05MTR LED Drivers 16-Bit LED Sink w/output error
VR1 VR2 = SparkFun:TRIMPOT
XTL = SparkFun:CRYSTAL: Crystals Various standard crystals. Proven footprints. Spark Fun Electronics SKU : COM-00534